# EAGLE design PDM_Final (EAGLE 6.6.0)
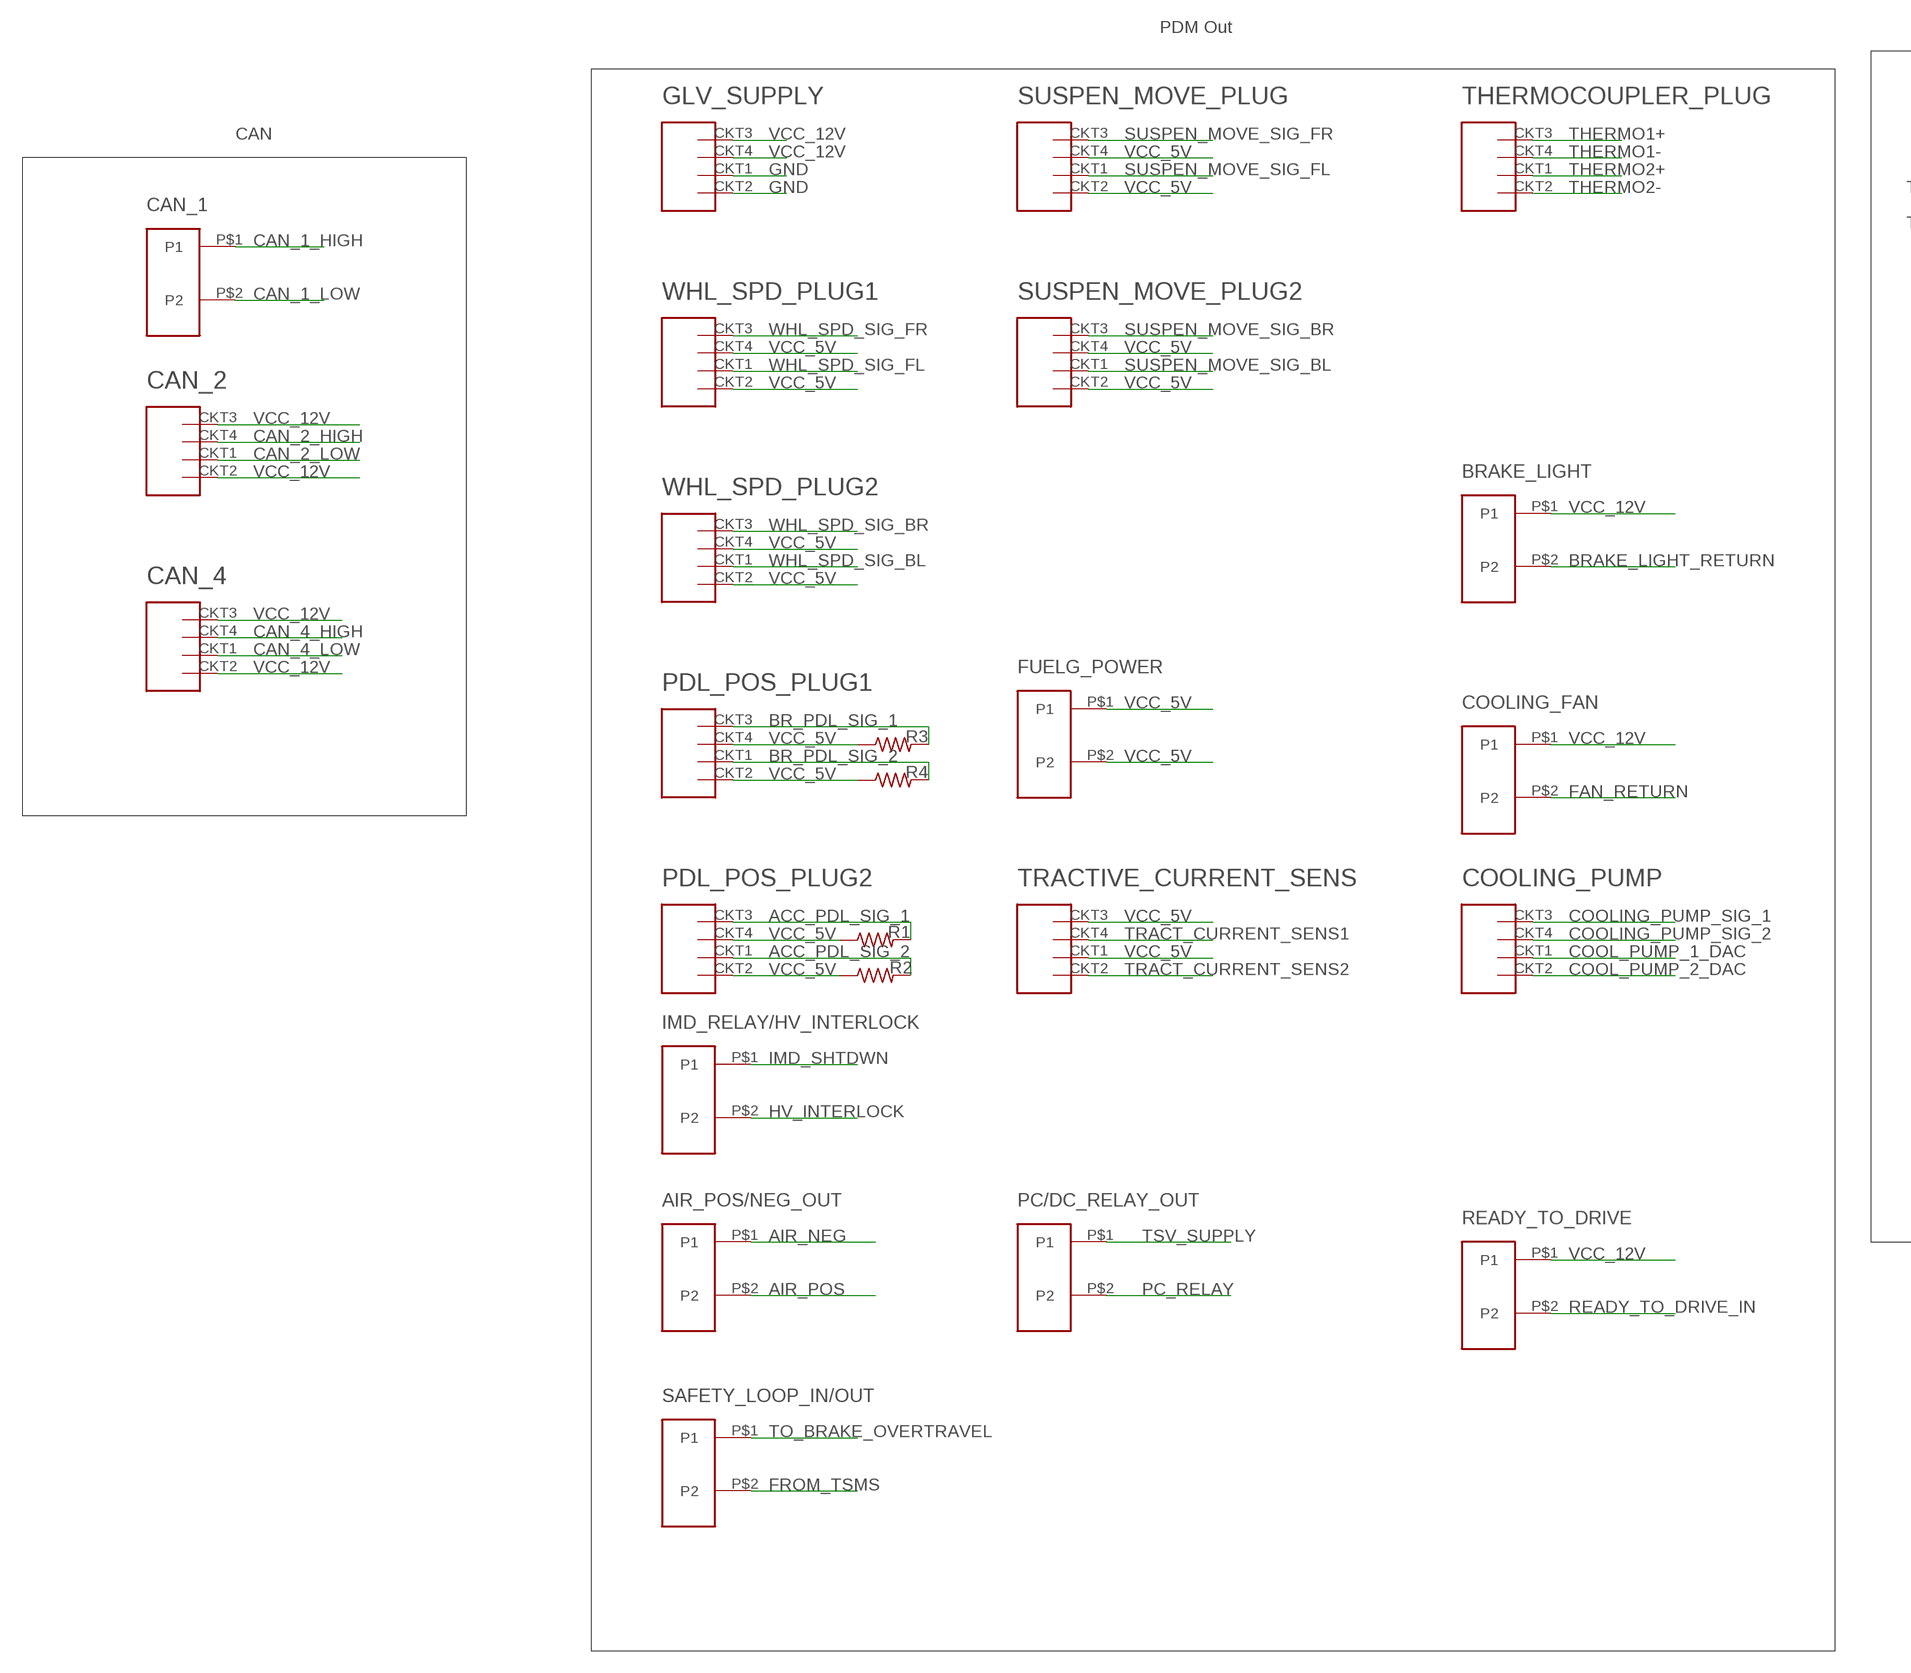
[diagram p0: schematic, sheet 1, part 1 of 2]
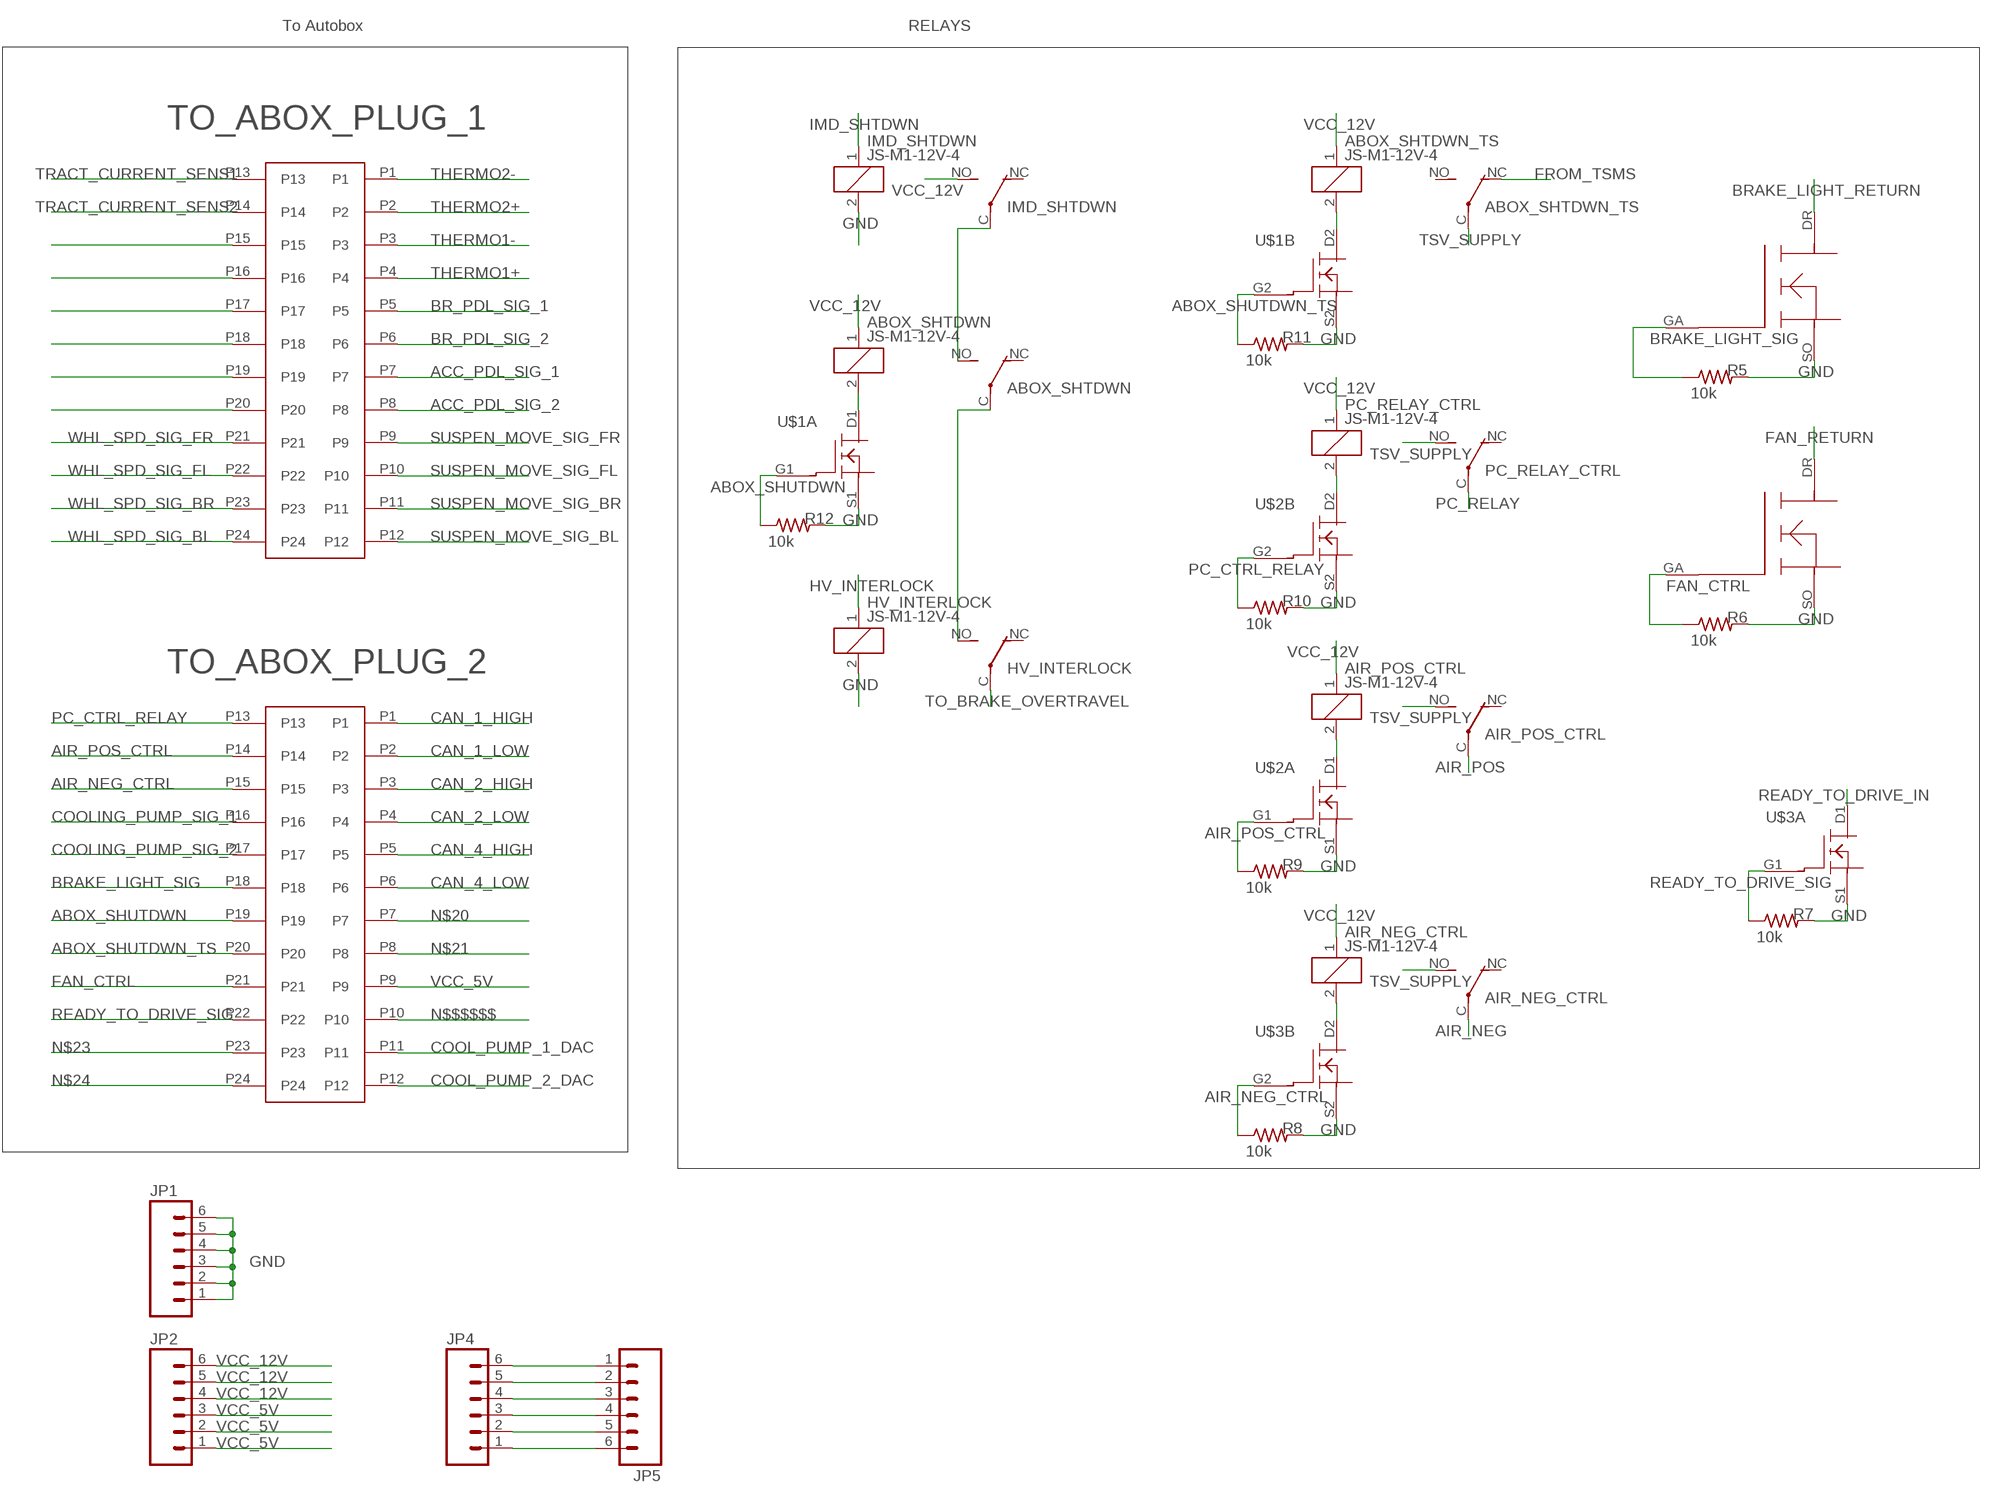
[diagram p1: schematic, sheet 1, part 2 of 2]

## Parts
ABOX_SHTDWN  JS-M1-12V-4  [JS-M]
ABOX_SHTDWN_TS  JS-M1-12V-4  [JS-M]
AIR_NEG_CTRL  JS-M1-12V-4  [JS-M]
AIR_POS/NEG_OUT  MINIFIT_2PIN  [2PIN_MOLEXMINIFIT]
AIR_POS_CTRL  JS-M1-12V-4  [JS-M]
BRAKE_LIGHT  MINIFIT_2PIN  [2PIN_MOLEXMINIFIT]
CAN_1  MINIFIT_2PIN  [2PIN_MOLEXMINIFIT]
CAN_2  MHYBRIDMOLEX  [MOLEXMINIFIT6]
CAN_4  MHYBRIDMOLEX  [MOLEXMINIFIT6]
COOLING_FAN  MINIFIT_2PIN  [2PIN_MOLEXMINIFIT]
COOLING_PUMP  MHYBRIDMOLEX  [MOLEXMINIFIT6]
FUELG_POWER  MINIFIT_2PIN  [2PIN_MOLEXMINIFIT]
GLV_SUPPLY  MHYBRIDMOLEX  [MOLEXMINIFIT6]
HV_INTERLOCK  JS-M1-12V-4  [JS-M]
IMD_RELAY/HV_INTERLOCK  MINIFIT_2PIN  [2PIN_MOLEXMINIFIT]
IMD_SHTDWN  JS-M1-12V-4  [JS-M]
JP1  M06LOCK  [1X06_LOCK]
JP2  M06LOCK  [1X06_LOCK]
JP4  M06LOCK  [1X06_LOCK]
JP5  M06LOCK  [1X06_LOCK]
PC/DC_RELAY_OUT  MINIFIT_2PIN  [2PIN_MOLEXMINIFIT]
PC_RELAY_CTRL  JS-M1-12V-4  [JS-M]
PDL_POS_PLUG1  MHYBRIDMOLEX  [MOLEXMINIFIT6]
PDL_POS_PLUG2  MHYBRIDMOLEX  [MOLEXMINIFIT6]
R1  R-US_0204/2V  [0204V]
R2  R-US_0204/2V  [0204V]
R3  R-US_0204/2V  [0204V]
R4  R-US_0204/2V  [0204V]
R5  10k  R-US_0204/2V  [0204V]
R6  10k  R-US_0204/2V  [0204V]
R7  10k  R-US_0204/2V  [0204V]
R8  10k  R-US_0204/2V  [0204V]
R9  10k  R-US_0204/2V  [0204V]
R10  10k  R-US_0204/2V  [0204V]
R11  10k  R-US_0204/2V  [0204V]
R12  10k  R-US_0204/2V  [0204V]
READY_TO_DRIVE  MINIFIT_2PIN  [2PIN_MOLEXMINIFIT]
SAFETY_LOOP_IN/OUT  MINIFIT_2PIN  [2PIN_MOLEXMINIFIT]
SUSPEN_MOVE_PLUG  MHYBRIDMOLEX  [MOLEXMINIFIT6]
SUSPEN_MOVE_PLUG2  MHYBRIDMOLEX  [MOLEXMINIFIT6]
THERMOCOUPLER_PLUG  MHYBRIDMOLEX  [MOLEXMINIFIT6]
TO_ABOX_PLUG_1  24PIN_MOLEX  [24PIN_MOLEX]
TO_ABOX_PLUG_2  24PIN_MOLEX  [24PIN_MOLEX]
TRACTIVE_CURRENT_SENS  MHYBRIDMOLEX  [MOLEXMINIFIT6]
U$1  COMBINED_TRANSIS  [TRANSIS_6]
U$2  COMBINED_TRANSIS  [TRANSIS_6]
U$3  COMBINED_TRANSIS  [TRANSIS_6]
U$4  HIGH_AMP_TRANS  [HIGH_AMP_TRANS]
U$5  HIGH_AMP_TRANS  [HIGH_AMP_TRANS]
WHL_SPD_PLUG1  MHYBRIDMOLEX  [MOLEXMINIFIT6]
WHL_SPD_PLUG2  MHYBRIDMOLEX  [MOLEXMINIFIT6]

## Nets
ABOX_SHUTDWN: R12.1 TO_ABOX_PLUG_2.P19 U$1.G1(A:GA)
ABOX_SHUTDWN_TS: R11.1 TO_ABOX_PLUG_2.P20 U$1.G2(B:GA)
ACC_PDL_SIG_1: PDL_POS_PLUG2.CKT3(V_IN(12)) R1.2 TO_ABOX_PLUG_1.P7
ACC_PDL_SIG_2: PDL_POS_PLUG2.CKT1(GND) R2.2 TO_ABOX_PLUG_1.P8
AIR_NEG: AIR_NEG_CTRL.C(2:P) AIR_POS/NEG_OUT.P$1(P1)
AIR_NEG_CTRL: R8.1 TO_ABOX_PLUG_2.P15 U$3.G2(B:GA)
AIR_POS: AIR_POS/NEG_OUT.P$2(P2) AIR_POS_CTRL.C(2:P)
AIR_POS_CTRL: R9.1 TO_ABOX_PLUG_2.P14 U$2.G1(A:GA)
BR_PDL_SIG_1: PDL_POS_PLUG1.CKT3(V_IN(12)) R3.2 TO_ABOX_PLUG_1.P5
BR_PDL_SIG_2: PDL_POS_PLUG1.CKT1(GND) R4.2 TO_ABOX_PLUG_1.P6
BRAKE_LIGHT_RETURN: BRAKE_LIGHT.P$2(P2) U$4.DR
BRAKE_LIGHT_SIG: R5.1 TO_ABOX_PLUG_2.P18 U$4.GA
CAN_1_HIGH: CAN_1.P$1(P1) TO_ABOX_PLUG_2.P1
CAN_1_LOW: CAN_1.P$2(P2) TO_ABOX_PLUG_2.P2
CAN_2_HIGH: CAN_2.CKT4(V_IN2(12)) TO_ABOX_PLUG_2.P3
CAN_2_LOW: CAN_2.CKT1(GND) TO_ABOX_PLUG_2.P4
CAN_4_HIGH: CAN_4.CKT4(V_IN2(12)) TO_ABOX_PLUG_2.P5
CAN_4_LOW: CAN_4.CKT1(GND) TO_ABOX_PLUG_2.P6
COOL_PUMP_1_DAC: COOLING_PUMP.CKT1(GND) TO_ABOX_PLUG_2.P11
COOL_PUMP_2_DAC: COOLING_PUMP.CKT2(GND2) TO_ABOX_PLUG_2.P12
COOLING_PUMP_SIG_1: COOLING_PUMP.CKT3(V_IN(12)) TO_ABOX_PLUG_2.P16
COOLING_PUMP_SIG_2: COOLING_PUMP.CKT4(V_IN2(12)) TO_ABOX_PLUG_2.P17
FAN_CTRL: R6.1 TO_ABOX_PLUG_2.P21 U$5.GA
FAN_RETURN: COOLING_FAN.P$2(P2) U$5.DR
FROM_TSMS: ABOX_SHTDWN_TS.NC(2:O) SAFETY_LOOP_IN/OUT.P$2(P2)
GND: GLV_SUPPLY.CKT1(GND) GLV_SUPPLY.CKT2(GND2) HV_INTERLOCK.2 IMD_SHTDWN.2 JP1.1 JP1.2 JP1.3 JP1.4 JP1.5 JP1.6 R5.2 R6.2 R7.2 R8.2 R9.2 R10.2 R11.2 R12.2 U$1.S1(A:SO) U$1.S2(B:SO) U$2.S1(A:SO) U$2.S2(B:SO) U$3.S1(A:SO) U$3.S2(B:SO) U$4.SO U$5.SO
HV_INTERLOCK: HV_INTERLOCK.1 IMD_RELAY/HV_INTERLOCK.P$2(P2)
IMD_SHTDWN: IMD_RELAY/HV_INTERLOCK.P$1(P1) IMD_SHTDWN.1
N$1: ABOX_SHTDWN.2 U$1.D1(A:DR)
N$2: ABOX_SHTDWN.NO(2:S) IMD_SHTDWN.C(2:P)
N$3: ABOX_SHTDWN.C(2:P) HV_INTERLOCK.NO(2:S)
N$4: ABOX_SHTDWN_TS.2 U$1.D2(B:DR)
N$5: PC_RELAY_CTRL.2 U$2.D2(B:DR)
N$6: TO_ABOX_PLUG_1.P20
N$7: TO_ABOX_PLUG_1.P19
N$8: TO_ABOX_PLUG_1.P18
N$9: TO_ABOX_PLUG_1.P17
N$10: TO_ABOX_PLUG_1.P16
N$11: TO_ABOX_PLUG_1.P15
N$12: AIR_POS_CTRL.2 U$2.D1(A:DR)
N$13: AIR_NEG_CTRL.2 U$3.D2(B:DR)
N$20: TO_ABOX_PLUG_2.P7
N$21: TO_ABOX_PLUG_2.P8
N$23: TO_ABOX_PLUG_2.P23
N$24: TO_ABOX_PLUG_2.P24
N$40: JP4.6 JP5.1
N$41: JP4.5 JP5.2
N$42: JP4.4 JP5.3
N$43: JP4.3 JP5.4
N$44: JP4.2 JP5.5
N$45: JP4.1 JP5.6
N$$$$$$: TO_ABOX_PLUG_2.P10
PC_CTRL_RELAY: R10.1 TO_ABOX_PLUG_2.P13 U$2.G2(B:GA)
PC_RELAY: PC/DC_RELAY_OUT.P$2(P2) PC_RELAY_CTRL.C(2:P)
READY_TO_DRIVE_IN: READY_TO_DRIVE.P$2(P2) U$3.D1(A:DR)
READY_TO_DRIVE_SIG: R7.1 TO_ABOX_PLUG_2.P22 U$3.G1(A:GA)
SUSPEN_MOVE_SIG_BL: SUSPEN_MOVE_PLUG2.CKT1(GND) TO_ABOX_PLUG_1.P12
SUSPEN_MOVE_SIG_BR: SUSPEN_MOVE_PLUG2.CKT3(V_IN(12)) TO_ABOX_PLUG_1.P11
SUSPEN_MOVE_SIG_FL: SUSPEN_MOVE_PLUG.CKT1(GND) TO_ABOX_PLUG_1.P10
SUSPEN_MOVE_SIG_FR: SUSPEN_MOVE_PLUG.CKT3(V_IN(12)) TO_ABOX_PLUG_1.P9
THERMO1+: THERMOCOUPLER_PLUG.CKT3(V_IN(12)) TO_ABOX_PLUG_1.P4
THERMO1-: THERMOCOUPLER_PLUG.CKT4(V_IN2(12)) TO_ABOX_PLUG_1.P3
THERMO2+: THERMOCOUPLER_PLUG.CKT1(GND) TO_ABOX_PLUG_1.P2
THERMO2-: THERMOCOUPLER_PLUG.CKT2(GND2) TO_ABOX_PLUG_1.P1
TO_BRAKE_OVERTRAVEL: HV_INTERLOCK.C(2:P) SAFETY_LOOP_IN/OUT.P$1(P1)
TRACT_CURRENT_SENS1: TO_ABOX_PLUG_1.P13 TRACTIVE_CURRENT_SENS.CKT4(V_IN2(12))
TRACT_CURRENT_SENS2: TO_ABOX_PLUG_1.P14 TRACTIVE_CURRENT_SENS.CKT2(GND2)
TSV_SUPPLY: ABOX_SHTDWN_TS.C(2:P) AIR_NEG_CTRL.NO(2:S) AIR_POS_CTRL.NO(2:S) PC/DC_RELAY_OUT.P$1(P1) PC_RELAY_CTRL.NO(2:S)
VCC_5V: FUELG_POWER.P$1(P1) FUELG_POWER.P$2(P2) JP2.1 JP2.2 JP2.3 PDL_POS_PLUG1.CKT2(GND2) PDL_POS_PLUG1.CKT4(V_IN2(12)) PDL_POS_PLUG2.CKT2(GND2) PDL_POS_PLUG2.CKT4(V_IN2(12)) R1.1 R2.1 R3.1 R4.1 SUSPEN_MOVE_PLUG2.CKT2(GND2) SUSPEN_MOVE_PLUG2.CKT4(V_IN2(12)) SUSPEN_MOVE_PLUG.CKT2(GND2) SUSPEN_MOVE_PLUG.CKT4(V_IN2(12)) TO_ABOX_PLUG_2.P9 TRACTIVE_CURRENT_SENS.CKT1(GND) TRACTIVE_CURRENT_SENS.CKT3(V_IN(12)) WHL_SPD_PLUG1.CKT2(GND2) WHL_SPD_PLUG1.CKT4(V_IN2(12)) WHL_SPD_PLUG2.CKT2(GND2) WHL_SPD_PLUG2.CKT4(V_IN2(12))
VCC_12V: ABOX_SHTDWN.1 ABOX_SHTDWN_TS.1 AIR_NEG_CTRL.1 AIR_POS_CTRL.1 BRAKE_LIGHT.P$1(P1) CAN_2.CKT2(GND2) CAN_2.CKT3(V_IN(12)) CAN_4.CKT2(GND2) CAN_4.CKT3(V_IN(12)) COOLING_FAN.P$1(P1) GLV_SUPPLY.CKT3(V_IN(12)) GLV_SUPPLY.CKT4(V_IN2(12)) IMD_SHTDWN.NO(2:S) JP2.4 JP2.5 JP2.6 PC_RELAY_CTRL.1 READY_TO_DRIVE.P$1(P1)
WHL_SPD_SIG_BL: TO_ABOX_PLUG_1.P24 WHL_SPD_PLUG2.CKT1(GND)
WHL_SPD_SIG_BR: TO_ABOX_PLUG_1.P23 WHL_SPD_PLUG2.CKT3(V_IN(12))
WHL_SPD_SIG_FL: TO_ABOX_PLUG_1.P22 WHL_SPD_PLUG1.CKT1(GND)
WHL_SPD_SIG_FR: TO_ABOX_PLUG_1.P21 WHL_SPD_PLUG1.CKT3(V_IN(12))
Unconnected: ABOX_SHTDWN.NC(2:O) ABOX_SHTDWN_TS.NO(2:S) AIR_NEG_CTRL.NC(2:O) AIR_POS_CTRL.NC(2:O) HV_INTERLOCK.NC(2:O) IMD_SHTDWN.NC(2:O) PC_RELAY_CTRL.NC(2:O)

## Notes on the sheet
- PDM Out | To Autobox | RELAYS
- CAN

## Library data of the parts
ABOX_SHTDWN ABOX_SHTDWN_TS AIR_NEG_CTRL AIR_POS_CTRL HV_INTERLOCK IMD_SHTDWN PC_RELAY_CTRL = relay:JS-M1*: Automotive Ultra-Miniature Power Relay NAiS Source: http://www.mew-europe.com/.. en_ds_61211_0000.pdf; MPN: JSM1-12V-4; OC_FARNELL: 910338; OC_NEWARK: 13P4552
AIR_POS/NEG_OUT BRAKE_LIGHT CAN_1 COOLING_FAN FUELG_POWER IMD_RELAY/HV_INTERLOCK PC/DC_RELAY_OUT READY_TO_DRIVE SAFETY_LOOP_IN/OUT = mhybrid molex megaFit:MINIFIT_2PIN
CAN_2 CAN_4 COOLING_PUMP GLV_SUPPLY PDL_POS_PLUG1 PDL_POS_PLUG2 SUSPEN_MOVE_PLUG SUSPEN_MOVE_PLUG2 THERMOCOUPLER_PLUG TRACTIVE_CURRENT_SENS WHL_SPD_PLUG1 WHL_SPD_PLUG2 = mhybrid molex megaFit:MHYBRIDMOLEX
JP1 JP2 JP4 JP5 = SparkFun-Connectors:M06: Header 6 Standard 6-pin 0.1" header. Use with straight break away headers (SKU : PRT-00116), right angle break away headers (PRT-00553), swiss pins (PRT-00743), machine pins (PRT-00117), and female headers (PRT-00115). Molex polarized connector foot print use with SKU : PRT-08094 with associated crimp pins and housings. NOTES ON THE VARIANTS LOCK and LOCK_LONGPADS... This footprint was designed to help hold the alignment of a through-hole component (i.e. 6-pin header) while soldering it into place. You may notice that each hole has been shifted either up or down by 0.005 of an inch from it's more standard position (which is a perfectly straight line). This slight alteration caused the pins (the squares in the middle) to touch the edges of the holes. Because they are alternating, it causes a "brace" to hold the component in place. 0.005 has proven to be the perfect amount of "off-center" position when using our standard breakaway headers. Although looks a little odd when you look at the bare footprint, once you have a header in there, the alteration is very hard to notice. Also,if you push a header all the way into place, it is covered up entirely on the bottom side. This idea of altering the position of holes to aid alignment will be further integrated into the Sparkfun Library for other footprints. It can help hold any component with 3 or more connection pins.
R1-R12 = rcl:R-US_: RESISTOR, American symbol
TO_ABOX_PLUG_1 TO_ABOX_PLUG_2 = mhybrid molex megaFit:24PIN_MOLEX
U$1-U$3 = mhybrid molex megaFit:COMBINED_TRANSIS
U$4 U$5 = mhybrid molex megaFit:HIGH_AMP_TRANS

## Board
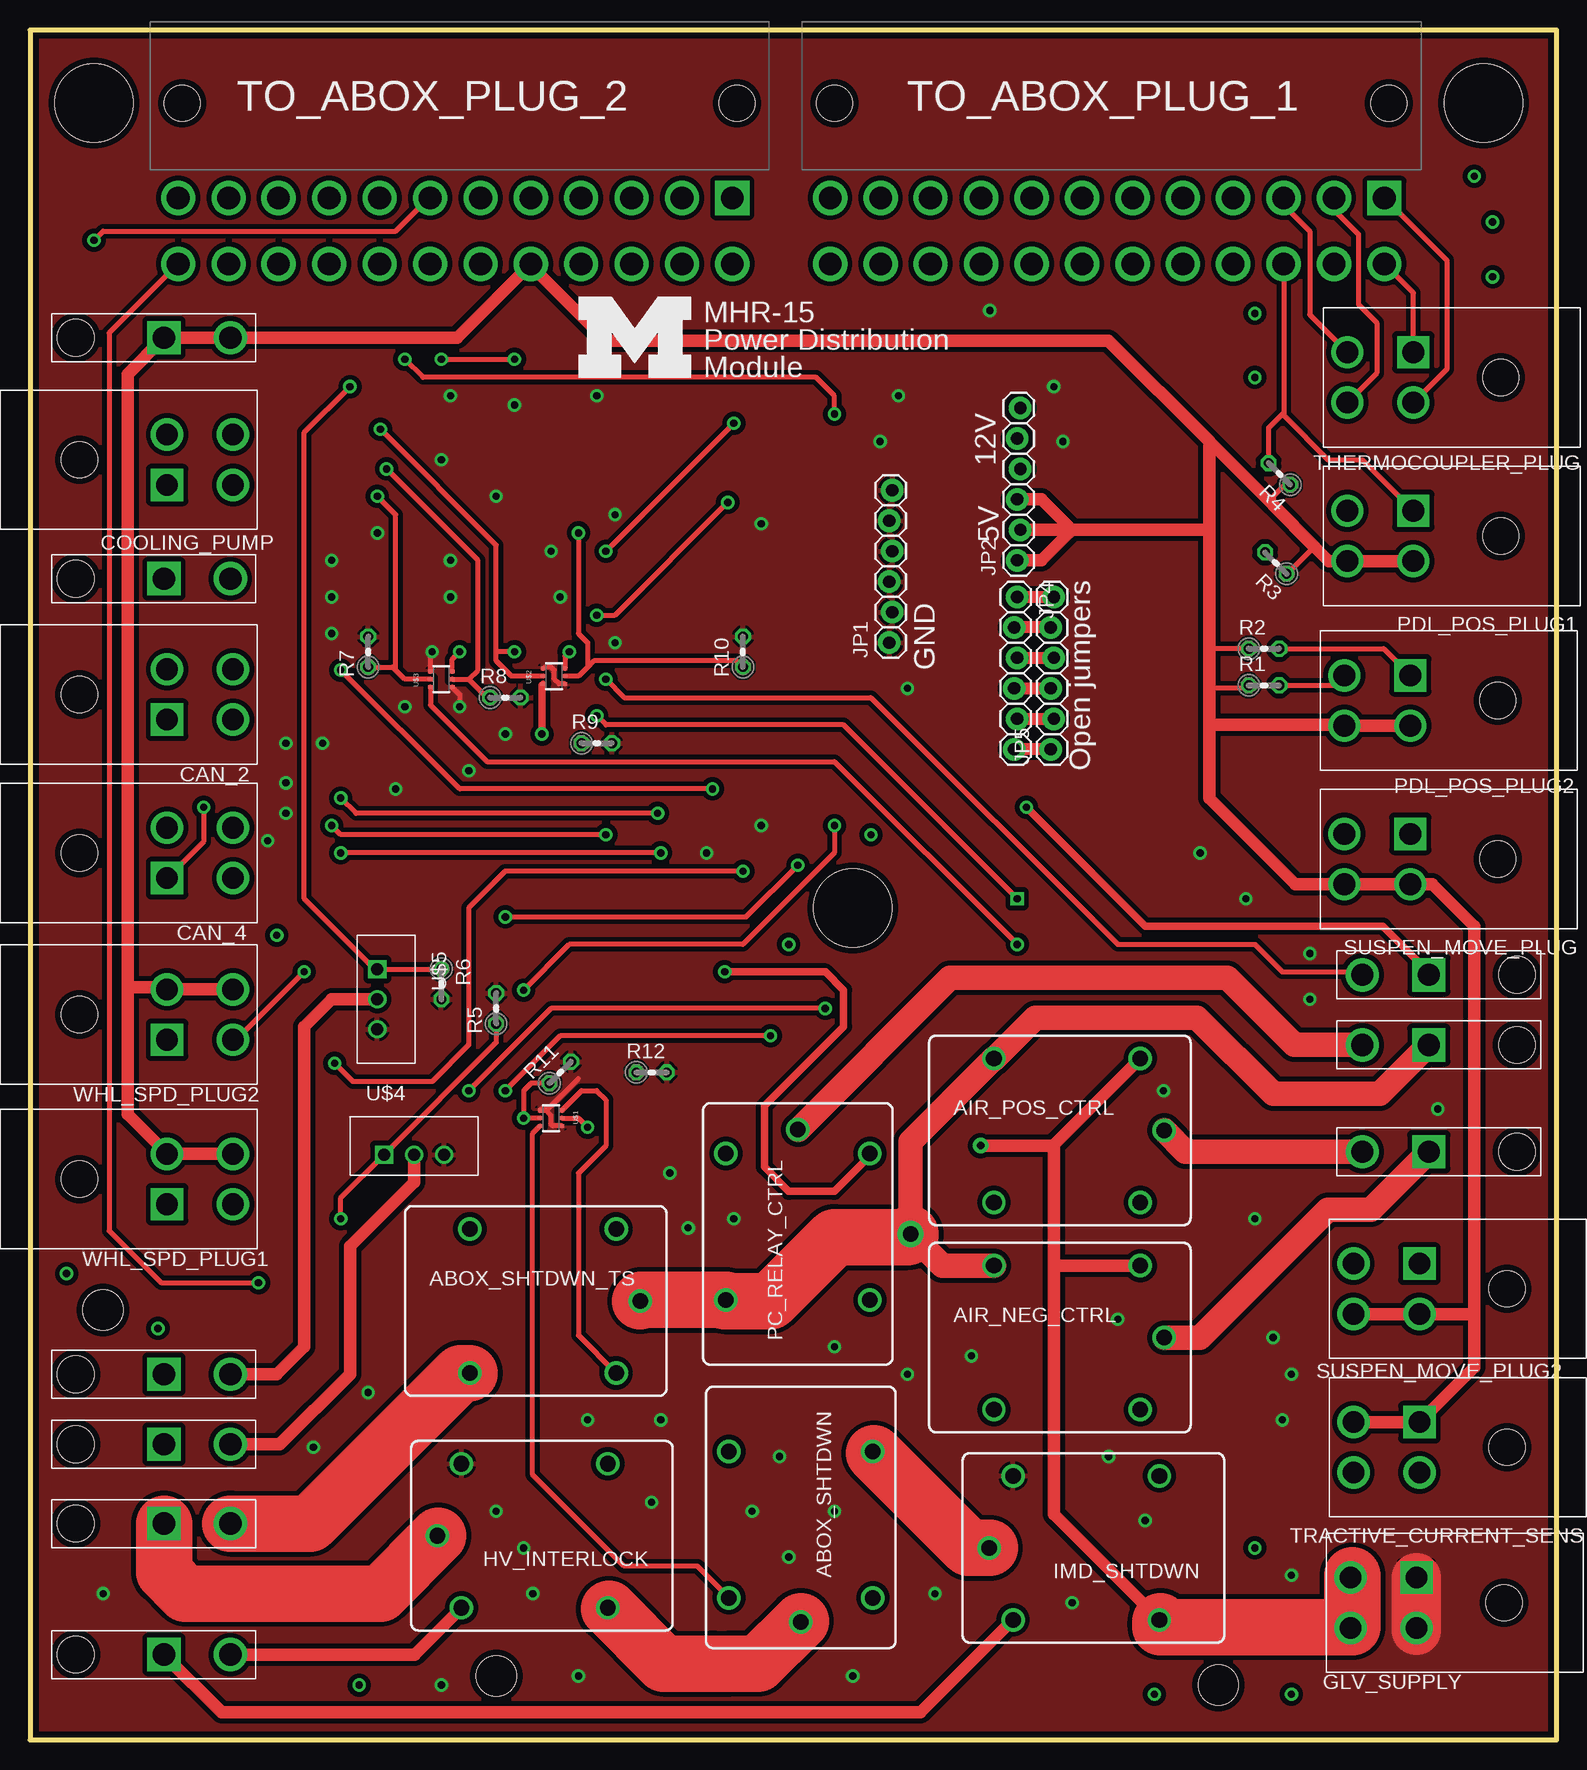
[diagram p2: board, top side]
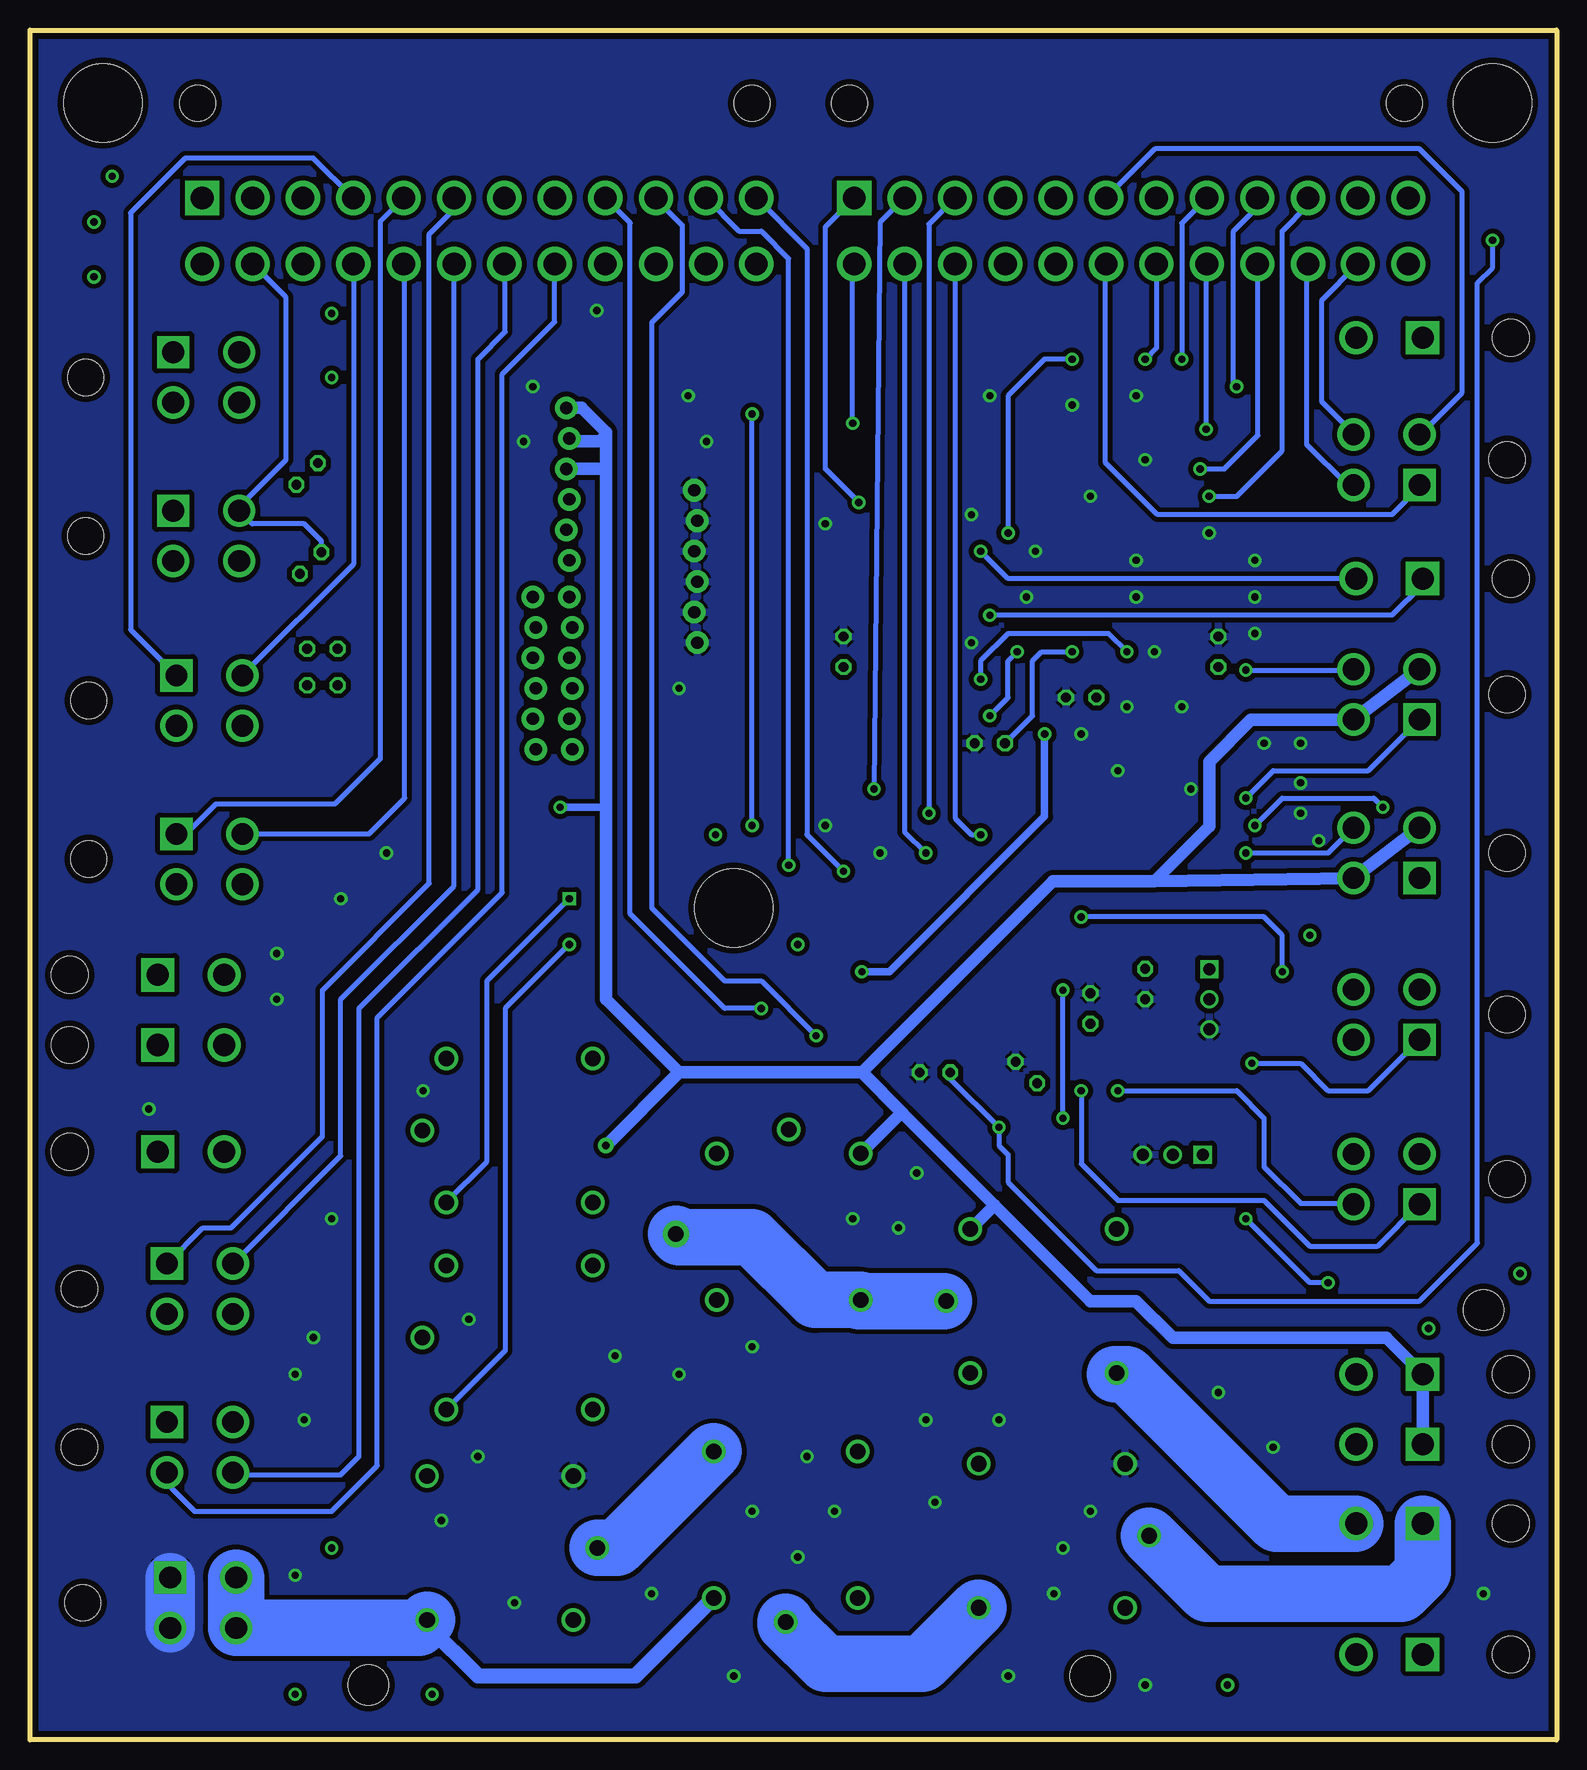
[diagram p3: board, bottom side, seen from below]

Size 127.25 x 142.49 mm. Coordinates in mm from the lower left corner, seen from the top.
Outline: 127.25,0 127.25,142.49 0,142.49 0,0 127.25,0
Copper layers (1+16): Top 0.0178mm / dielectric 12mil / Bottom 0.0178mm
Design rules "4PCB2layer": minimum track width 6mil, minimum drill 8mil, track to track 6mil, track to pad 6mil, pad to pad 6mil, via to via 6mil, smd to smd 6mil, copper to edge 20mil, drill to drill 16mil, minimum pad ring 10mil, minimum via ring 10mil, stop-mask expansion 3mil, vias tented up to drill 0mil, thermal gap 10mil
Holes 6.53 mm at 5.33,136.4 121.16,136.4 68.58,69.34
Holes 3.35 mm at 6.1,35.81 99.06,4.57 38.86,5.33

### Footprints (pad centres in the part's own frame; a part is rotated, then mirrored left to right if it is on the bottom)
JS-M = drill 1.3: 1 6.7,6; 2 6.7,-6; C 8.7,0; NC -5.5,-6; NO -5.5,6
2PIN_MOLEXMINIFIT = drill 1.85 square: P$1 0,7.35 | drill 1.85: P$2 0,12.89 | hole 3.05: 0,0
MOLEXMINIFIT6 = drill 1.8 square: CKT1 2.1,0 | drill 1.8: CKT2 -2.1,0; CKT3 2.1,5.5; CKT4 -2.1,5.5 | hole 3: 0,-7.3
1X06_LOCK = drill 1.016 pad 1.88: 1 0,0; 2 2.54,-0.254; 3 5.08,0; 4 7.62,-0.254; 5 10.16,0; 6 12.7,-0.254
0204V = drill 0.813 octagon: 1 -1.27,0; 2 1.27,0
24PIN_MOLEX = drill 1.9 square: P1 -22.735,7.9 | drill 1.9: P2 -22.735,13.4; P3 -18.53,7.9; P4 -14.33,7.9; P5 -18.53,13.4; P6 -14.33,13.4; P7 -10.12,13.4; P8 -10.12,7.9; P9 -5.94,13.4; P10 -5.94,7.9; P11 -1.74,13.4; P12 -1.74,7.9; P13 2.465,13.4; P14 6.665,13.4; P15 10.87,13.4; P16 15.1,13.4; P17 19.26,13.4; P18 23.465,13.4; P19 2.465,7.9; P20 6.665,7.9; P21 10.87,7.9; P22 15.1,7.9; P23 19.26,7.9; P24 23.465,7.9 | hole 2.997: -23.114,0; 23.114,0
TRANSIS_6 = smd 0.3 x 0.4: D1 0.65,-0.9; D2 -0.65,0.9; G1 0,0.9; G2 0,-0.9; S1 0.65,0.9; S2 -0.65,-0.9
HIGH_AMP_TRANS = drill 1: DR 0,0; SO 2.5,0 | drill 1 square: GA -2.5,0

### Placement (x,y rotation side)
ABOX_SHTDWN  64.26,18.54 270 top
ABOX_SHTDWN_TS  42.16,36.58 0 top
AIR_NEG_CTRL  85.85,33.53 0 top
AIR_POS/NEG_OUT  123.95,49.02 90 top
AIR_POS_CTRL  85.85,50.8 0 top
BRAKE_LIGHT  3.81,24.64 270 top
CAN_1  3.81,96.77 270 top
CAN_2  11.43,87.12 270 top
CAN_4  11.43,73.91 270 top
COOLING_FAN  3.81,30.48 270 top
COOLING_PUMP  11.43,106.68 270 top
FUELG_POWER  3.81,116.84 270 top
GLV_SUPPLY  115.57,11.43 90 top
HV_INTERLOCK  42.67,17.02 180 top
IMD_RELAY/HV_INTERLOCK  3.81,7.11 270 top
IMD_SHTDWN  88.65,16 180 top
JP1  71.63,91.44 90 top
JP2  82.3,98.3 90 top
JP4  82.3,95.25 270 top
JP5  85.09,82.55 90 top
PC/DC_RELAY_OUT  123.95,57.91 90 top
PC_RELAY_CTRL  64.01,42.16 90 top
PDL_POS_PLUG1  115.32,100.33 90 top
PDL_POS_PLUG2  115.06,86.61 90 top
R1  102.87,87.88 0 top
R2  102.87,90.93 0 top
R3  103.86,98.07 135 top
R4  104.15,105.5 135 top
R5  38.86,60.96 90 top
R6  34.29,62.99 270 top
R7  28.19,90.68 90 top
R8  39.62,86.87 0 top
R9  47.24,83.06 0 top
R10  59.44,90.68 90 top
R11  44.2,55.63 45 top
R12  51.82,55.63 0 top
READY_TO_DRIVE  123.95,63.75 90 top
SAFETY_LOOP_IN/OUT  3.81,18.03 270 top
SUSPEN_MOVE_PLUG  115.06,73.41 90 top
SUSPEN_MOVE_PLUG2  115.82,37.59 90 top
THERMOCOUPLER_PLUG  115.32,113.54 90 top
TO_ABOX_PLUG_1  90.17,136.4 180 top
TO_ABOX_PLUG_2  35.81,136.4 180 top
TRACTIVE_CURRENT_SENS  115.82,24.38 90 top
U$1  43.43,51.82 270 top
U$2  43.69,88.65 90 top
U$3  34.29,88.39 90 top
U$4  32,48.77 0 top
U$5  28.96,61.72 270 top
U$6  [BLOCKM]  45.72,113.54 0 top
WHL_SPD_PLUG1  11.43,46.74 270 top
WHL_SPD_PLUG2  11.43,60.45 270 top

### Tracks (layer width: path | path; a pad name or v marks a point on that pad's centre or on a via)
ABOX_SHUTDWN  (via drill 0.6)
  Top 0.406: U$1.G1 45.72,51.82 v46.48,51.05 | v5.33,124.97 6.1,125.73 30.48,125.73 33.35,128.6 | 33.53,128.78 33.35,128.6 | 33.35,128.6 TO_ABOX_PLUG_2.P19
  Bottom 0.406: v5.33,124.97 5.33,122.68 6.6,121.41 6.6,41.4 11.43,36.58 28.96,36.58 31.5,39.12 38.35,39.12 45.72,46.48 45.72,48.77 46.48,49.53 v46.48,51.05 50.55,55.12 R12.1
ABOX_SHUTDWN_TS  (via drill 0.6)
  Top 0.406: U$1.G2 v41.15,51.82 41.15,54.1 41.77,54.73 R11.1 | v41.15,62.48 44.96,66.29 59.44,66.29 67.06,73.91 v67.06,76.2 | v67.06,110.49 67.06,112.01 65.53,113.54 32.77,113.54 v31.24,115.06
  Bottom 0.406: TO_ABOX_PLUG_2.P20 31.24,126.41 v31.24,115.06 | v41.15,51.82 v41.15,62.48 | v67.06,76.2 v67.06,110.49
ACC_PDL_SIG_1
  Top 0.406: R1.2 108.73,87.88 PDL_POS_PLUG2.CKT3
  Bottom 0.406: TO_ABOX_PLUG_1.P7 100.29,97.99 PDL_POS_PLUG2.CKT3
ACC_PDL_SIG_2
  Top 0.406: R2.2 112.84,90.93 PDL_POS_PLUG2.CKT1
  Bottom 0.406: TO_ABOX_PLUG_1.P8 100.3,128.5 103.63,131.83 114.3,131.83 118.87,127.25 118.87,92.52 PDL_POS_PLUG2.CKT1
AIR_NEG
  Top 2.057: AIR_NEG_CTRL.C 97.54,33.53 108.2,44.2 111.78,44.2 AIR_POS/NEG_OUT.P$1
AIR_NEG_CTRL  (via drill 0.6)
  Top 0.406: U$3.G2 36.58,88.39 | 36.58,88.39 37.34,89.15 37.34,98.3 v29.72,105.92 | R8.1 38.1,86.87 36.58,88.39
  Bottom 0.406: v29.72,105.92 27.69,105.92 24.89,108.71 24.89,122.95 TO_ABOX_PLUG_2.P15
AIR_POS
  Top 2.057: AIR_POS_CTRL.C 96.33,49.02 AIR_POS/NEG_OUT.P$2
AIR_POS_CTRL  (via drill 0.6)
  Top 0.406: U$2.G1 40.13,88.65 38.86,89.92 38.86,90.68 | 38.86,90.68 38.86,99.57 v29.21,109.22 | v40.39,90.68 38.86,90.68
  Bottom 0.406: v29.21,109.22 29.21,122.94 TO_ABOX_PLUG_2.P14 | R9.1 43.69,85.34 43.69,89.92 42.93,90.68 v40.39,90.68
BR_PDL_SIG_1
  Bottom 0.406: TO_ABOX_PLUG_1.P5 105.92,120.22 105.92,106.68 109.82,102.78 PDL_POS_PLUG1.CKT3 108.73,101.35 104.39,101.35 102.96,99.91 R3.2
BR_PDL_SIG_2
  Top 0.406: TO_ABOX_PLUG_1.P6 104.5,110.49 | 104.5,110.49 104.5,110.38 108.2,106.68 111.07,106.68 PDL_POS_PLUG1.CKT1 | R4.2 103.25,109.35 104.39,110.49 104.5,110.49
BRAKE_LIGHT_RETURN
  Top 1.041: BRAKE_LIGHT.P$2 20.83,24.64 26.67,30.48 26.67,41.15 32,46.48 U$4.DR
BRAKE_LIGHT_SIG  (via drill 0.6)
  Top 0.406: TO_ABOX_PLUG_2.P18 6.6,117.25 6.6,42.42 10.92,38.1 v19.05,38.1 | v25.91,43.43 25.91,45.17 U$4.GA 38.86,58.13 R5.1
  Bottom 0.406: v19.05,38.1 20.57,38.1 v25.91,43.43
CAN_1_HIGH  (via drill 0.6)
  Top 0.406: v47.24,93.73 48.77,93.73 v58.17,103.12
  Bottom 0.406: TO_ABOX_PLUG_2.P1 60.96,126.09 60.96,105.92 v58.17,103.12 | CAN_1.P$1 11.16,96.28 13.72,93.73 v47.24,93.73
CAN_1_LOW  (via drill 0.6)
  Top 0.406: v48.01,99.06 v58.67,109.73
  Bottom 0.406: CAN_1.P$2 45.72,96.77 v48.01,99.06 | v58.67,109.73 58.67,122.87 TO_ABOX_PLUG_2.P2
CAN_2_HIGH  (via drill 0.6)
  Top 0.406: v56.9,79.25 35.81,79.25 v25.91,89.15
  Bottom 0.406: TO_ABOX_PLUG_2.P3 56.39,126.45 v56.9,79.25 | v25.91,89.15 17,89.15 CAN_2.CKT4
CAN_2_LOW  (via drill 0.6)
  Top 0.406: v52.32,77.22 27.18,77.22 v25.91,78.49
  Bottom 0.406: TO_ABOX_PLUG_2.P4 52.32,126.32 v52.32,77.22 | v25.91,78.49 23.62,80.77 15.68,80.77 CAN_2.CKT1
CAN_4_HIGH  (via drill 0.6)
  Top 0.406: v52.58,73.91 v25.91,73.91
  Bottom 0.406: TO_ABOX_PLUG_2.P5 54.34,75.68 v52.58,73.91 | v25.91,73.91 19.03,73.91 CAN_4.CKT4
CAN_4_LOW  (via drill 0.6)
  Top 0.406: v48.01,75.44 25.91,75.44 v25.15,76.2 | v14.48,77.72 14.48,74.86 CAN_4.CKT1
  Bottom 0.406: TO_ABOX_PLUG_2.P6 50.14,76.81 48.77,75.44 v48.01,75.44 | v25.15,76.2 22.86,78.49 15.24,78.49 v14.48,77.72
COOL_PUMP_1_DAC
  Bottom 0.406: COOLING_PUMP.CKT1 11.43,104.39 13.72,102.11 33.27,102.11 37.59,106.43 37.59,122.96 TO_ABOX_PLUG_2.P11
COOL_PUMP_2_DAC
  Bottom 0.406: COOLING_PUMP.CKT2 11.36,108.78 7.87,112.27 7.87,129.03 11.43,132.59 33.46,132.59 TO_ABOX_PLUG_2.P12
COOLING_PUMP_SIG_1
  Bottom 0.406: COOLING_PUMP.CKT3 17.46,104.58 20.83,107.95 20.83,122.88 TO_ABOX_PLUG_2.P16
COOLING_PUMP_SIG_2
  Bottom 0.406: COOLING_PUMP.CKT4 16.93,108.88 19.56,111.51 19.56,119.99 TO_ABOX_PLUG_2.P17
FAN_CTRL  (via drill 0.6)
  Top 0.406: v26.67,112.78 22.86,108.97 22.86,70.1 28.74,64.22 U$5.GA 34.25,64.22 R6.1
  Bottom 0.406: v26.67,112.78 26.92,113.03 26.92,125.73 24.94,127.71 TO_ABOX_PLUG_2.P21
FAN_RETURN
  Top 1.041: COOLING_FAN.P$2 20.57,30.48 22.86,32.77 22.86,59.44 25.15,61.72 U$5.DR
FROM_TSMS
  Top 4.699: SAFETY_LOOP_IN/OUT.P$2 23.37,18.03 35.91,30.58 ABOX_SHTDWN_TS.NC
GND  (via drill 0.6)
  Top 0.406: U$1.S1 43.58,51.17 43.43,51.31 43.43,52.07 42.93,52.58 42.65,52.58 U$1.S2 43.07,52.47 45.72,55.12 | U$2.S2 44.08,88 43.69,88.39 43.69,89.15 43.43,89.41 42.9,89.41 U$2.S1 | U$3.S1 33.39,90.54 v33.53,90.68 | U$3.S2 35.81,87.12 v35.81,86.11
  Top 4.115: GLV_SUPPLY.CKT1 115.57,9.14
  Bottom 4.115: GLV_SUPPLY.CKT1 GLV_SUPPLY.CKT2
  other vias: 39.62,83.82 43.43,99.06 40.39,111.25 38.86,103.63 34.29,106.68 35.05,112.01 47.24,112.01 48.77,102.11 28.96,100.58 25.15,98.3 25.15,95.25 25.15,92.2 31.24,86.11 36.58,80.77 30.48,79.25 24.38,83.06 21.34,83.06 21.34,79.76 21.34,77.22 19.81,74.93 35.05,95.25 35.05,98.3 44.2,95.25 48.77,91.44 60.96,76.2 56.39,73.91 60.96,101.35 70.87,108.2 86.11,108.2 85.34,112.78 80.01,119.13 97.54,73.91 101.35,70.1 94.49,54.1 102.11,43.43 103.63,33.53 53.34,47.24 104.39,26.67 105.16,13.72 45.72,5.33 34.29,4.57 52.58,26.67 46.48,26.67 75.44,12.19 63.25,15.24 60.2,19.05 62.48,23.62 41.15,16 38.86,19.05 41.91,12.19 51.82,19.81 67.06,19.05 67.06,32.77 73.15,30.48 78.49,32 86.87,11.43 92.96,18.29 89.92,23.62 90.68,35.05 58.67,43.43 54.86,42.67 105.16,30.48 117.35,52.58 106.68,61.72 23.62,24.38 28.19,28.96 6.1,12.19 68.58,5.33 106.68,65.53 72.39,112.01 73.15,87.63
  pour Bottom (isolate 0.406): 0,142.49 127.25,142.49 127.25,-0.76 0,-0.76
  pour Top (isolate 0.406): 0,142.49 127.25,142.49 127.25,0 0,0 0,141.73
HV_INTERLOCK
  Top 1.041: IMD_RELAY/HV_INTERLOCK.P$2 32.07,7.11 HV_INTERLOCK.1
IMD_SHTDWN
  Top 1.041: IMD_RELAY/HV_INTERLOCK.P$1 15.99,2.29 74.23,2.29 IMD_SHTDWN.1
N$1
  Top 0.406: ABOX_SHTDWN.2 55.63,14.48 49.53,14.48 41.91,22.1 41.91,50.54 U$1.D1
N$2
  Bottom 4.699: IMD_SHTDWN.C 78.3,16 ABOX_SHTDWN.NO
N$3
  Bottom 4.699: ABOX_SHTDWN.C 64.26,9.65 60.96,6.35 52.84,6.35 HV_INTERLOCK.NO
N$4
  Top 0.406: U$1.D2 45.97,54.1 47.24,54.1 48.01,53.34 48.01,49.53 45.72,47.24 45.72,33.72 ABOX_SHTDWN_TS.2
N$5  (via drill 0.6)
  Top 0.559: 42.67,87.88 U$2.D2
  Top 0.61: PC_RELAY_CTRL.2 70.01,48.67 67.06,45.72 63.25,45.72 61.21,47.75 61.21,52.83 67.82,59.44 67.82,62.48 66.29,64.01 v57.91,64.01 | v42.67,83.82 42.67,87.88
  Bottom 0.61: v57.91,64.01 55.63,64.01 42.67,76.96 v42.67,83.82
N$12  (via drill 0.6)
  Top 0.406: v82.3,70.1 67.82,84.58 48.01,84.58 v47.24,85.34 | v44.96,90.68 44.59,90.31 U$2.D1
  Bottom 0.406: AIR_POS_CTRL.2 89.15,48.2 89.15,63.25 v82.3,70.1 | v47.24,85.34 45.72,86.87 45.72,89.92 v44.96,90.68
N$13  (via drill 0.6)
  Top 0.406: U$3.D2 33.39,86.24 38.1,81.53 67.06,81.53 v82.3,66.29
  Bottom 0.406: AIR_NEG_CTRL.2 87.63,32.45 87.63,60.96 v82.3,66.29
N$30
  Top 4.699: 110.24,13.72 110.24,9.4 94.23,9.4 94.23,9.91
N$31
  Top 4.699: 70.36,23.88 78.23,16 80.01,16
N$35
  Top 4.699: 34.04,17.02 29.21,12.19 12.95,12.19 11.18,13.97 11.18,18.03
N$36
  Bottom 4.699: 16.76,18.03 23.37,18.03 35.81,30.48 36.83,30.48
N$37
  Bottom 4.699: 51.05,36.58 58.17,36.58
N$38
  Top 4.699: 48.26,10.92 52.83,6.35 56.9,6.35 58.42,6.35 60.71,6.35 64.26,9.91
N$40
  Top 1.016: JP5.1 JP4.6
N$41
  Top 1.016: JP4.5 JP5.2
N$42
  Top 1.016: JP4.4 JP5.3
N$43
  Top 1.016: JP4.3 JP5.4
N$44
  Top 1.016: JP5.5 JP4.2
N$45
  Top 1.016: JP4.1 JP5.6
N$48  (via drill 0.6)
  other vias: 10.67,34.29
N$49  (via drill 0.6)
  other vias: 93.73,3.81
N$50  (via drill 0.6)
  other vias: 105.16,3.81
N$51  (via drill 0.6)
  other vias: 70.1,75.44
N$52  (via drill 0.6)
  other vias: 63.25,66.29
N$53  (via drill 0.6)
  other vias: 20.57,67.06
N$54  (via drill 0.6)
  other vias: 3.05,38.86
N$55  (via drill 0.6)
  other vias: 27.43,4.57
N$56  (via drill 0.6)
  other vias: 102.11,16
N$57  (via drill 0.6)
  other vias: 121.92,121.92
N$58  (via drill 0.6)
  other vias: 121.92,126.49
N$59  (via drill 0.6)
  other vias: 120.4,130.3
N$60  (via drill 0.6)
  other vias: 102.11,118.87
N$61  (via drill 0.6)
  other vias: 102.11,113.54
PC_CTRL_RELAY  (via drill 0.6)
  Top 0.406: v34.29,115.06 v40.39,115.06 | v45.72,100.58 45.72,92.2 46.48,91.44 46.48,89.41 | 46.48,89.41 45.72,88.65 U$2.G2 | R10.1 58.93,89.92 46.99,89.92 46.48,89.41
  Bottom 0.406: TO_ABOX_PLUG_2.P13 33.35,116 v34.29,115.06 | v40.39,115.06 42.67,115.06 45.72,112.01 v45.72,100.58
PC_RELAY
  Top 2.057: PC_RELAY_CTRL.C 64.07,50.86 76.71,63.5 99.82,63.5 105.41,57.91 PC/DC_RELAY_OUT.P$2
READY_TO_DRIVE_IN  (via drill 0.6)
  Top 0.406: U$3.D1 35.19,90.05 v35.81,90.68 | READY_TO_DRIVE.P$2 110.81,64.01 104.39,64.01 102.11,66.29 90.68,66.29 70.1,86.87 49.53,86.87 v48.01,88.39
  Bottom 0.406: v35.81,90.68 37.34,92.2 45.72,92.2 48.01,89.92 v48.01,88.39
READY_TO_DRIVE_SIG  (via drill 0.6)
  Top 0.406: U$3.G1 31.24,88.39 30.48,89.15 | 30.48,89.15 30.48,102.11 v28.96,103.63 | R7.1 30.23,89.41 30.48,89.15
  Bottom 0.406: v28.96,103.63 26.67,103.63 22.86,107.44 22.86,125.73 20.71,127.88 TO_ABOX_PLUG_2.P22
SUSPEN_MOVE_SIG_BL
  Bottom 0.406: SUSPEN_MOVE_PLUG2.CKT1 112.84,42.67 110.49,42.67 102.87,50.29 102.87,62.48 93.98,71.37 93.98,125.48 91.91,127.55 TO_ABOX_PLUG_1.P12
SUSPEN_MOVE_SIG_BR
  Bottom 0.406: SUSPEN_MOVE_PLUG2.CKT3 101.35,48.67 101.35,61.72 91.91,71.16 TO_ABOX_PLUG_1.P11
SUSPEN_MOVE_SIG_FL
  Bottom 0.406: 114.99,75.51 SUSPEN_MOVE_PLUG.CKT1 114.23,75.51 111.76,77.98 101.85,77.98 98.04,81.79 98.04,126.56 TO_ABOX_PLUG_1.P10
SUSPEN_MOVE_SIG_FR
  Bottom 0.406: SUSPEN_MOVE_PLUG.CKT3 98.99,75.51 96.01,78.49 96.01,122.9 TO_ABOX_PLUG_1.P9
THERMO1+
  Top 0.406: TO_ABOX_PLUG_1.P4 104.5,127.91 106.68,125.73 106.68,118.77 THERMOCOUPLER_PLUG.CKT3
THERMO1-
  Top 0.406: TO_ABOX_PLUG_1.P3 108.7,127.52 110.74,125.48 110.74,119.63 112.27,118.11 112.27,113.89 THERMOCOUPLER_PLUG.CKT4
THERMO2+
  Top 0.406: THERMOCOUPLER_PLUG.CKT1 115.32,120.59 TO_ABOX_PLUG_1.P2
THERMO2-
  Top 0.406: TO_ABOX_PLUG_1.P1 118.11,123.29 118.11,114.23 THERMOCOUPLER_PLUG.CKT2
TO_BRAKE_OVERTRAVEL
  Bottom 4.699: HV_INTERLOCK.C 29.15,12.19 12.95,12.19 11.16,13.99 SAFETY_LOOP_IN/OUT.P$1
TRACT_CURRENT_SENS1
  Bottom 0.406: TRACTIVE_CURRENT_SENS.CKT4 110.14,22.1 101.35,22.1 99.82,23.62 99.82,60.96 89.92,70.87 89.92,115.06 87.63,117.35 87.63,122.92 TO_ABOX_PLUG_1.P13
TRACT_CURRENT_SENS2
  Bottom 0.406: TRACTIVE_CURRENT_SENS.CKT2 115.82,21.34 113.54,19.05 102.11,19.05 98.3,22.86 98.3,60.2 87.88,70.61 87.88,113.79 83.5,118.17 TO_ABOX_PLUG_1.P14 83.31,122.81
TSV_SUPPLY  (via drill 1.3 pad 2.18)
  Top 2.057: v73.41,42.16 76.04,39.53 AIR_NEG_CTRL.NO | AIR_POS_CTRL.NO 80.35,56.73 | 73.91,42.67 v73.41,42.16 | v73.41,42.16 73.41,49.85 AIR_POS_CTRL.NO | AIR_POS_CTRL.NO 80.42,56.8 83.82,60.2 97.28,60.2 103.63,53.85 112.54,53.85 PC/DC_RELAY_OUT.P$1
  Top 4.699: ABOX_SHTDWN_TS.C 50.95,36.66 PC_RELAY_CTRL.NO | 57.91,36.58 61.72,36.58 67.06,41.91 73.15,41.91 arc90 v73.41,42.16
  Bottom 4.699: PC_RELAY_CTRL.NO 61.81,36.66 67.06,41.91 73.15,41.91 v73.41,42.16
VCC_5V
  Top 0.406: R1.1 101.35,87.63 98.3,87.63 | R2.1 98.55,90.93 98.3,90.68 | R4.1 104.6,104.6 103.63,103.63 103.63,102.87 | R3.1 104.8,97.18 107.06,99.44
  Top 1.041: 8.13,62.74 8.13,113.81 FUELG_POWER.P$1 FUELG_POWER.P$2 35.6,116.84 TO_ABOX_PLUG_2.P9 41.75,122.84 48.01,116.59 89.92,116.59 98.3,108.2 | 98.3,108.2 103.63,102.87 107.06,99.44 108.27,98.23 PDL_POS_PLUG1.CKT4 PDL_POS_PLUG1.CKT2 | PDL_POS_PLUG2.CKT2 PDL_POS_PLUG2.CKT4 109.66,84.51 109.73,84.58 98.3,84.58 | 120.4,35.81 120.4,67.82 116.91,71.31 SUSPEN_MOVE_PLUG.CKT2 SUSPEN_MOVE_PLUG.CKT4 105.48,71.31 98.3,78.49 98.3,84.58 | 120.4,35.81 120.4,31.06 TRACTIVE_CURRENT_SENS.CKT1 115.64,26.67 115.06,26.67 114.88,26.48 TRACTIVE_CURRENT_SENS.CKT3 | SUSPEN_MOVE_PLUG2.CKT4 SUSPEN_MOVE_PLUG2.CKT2 120.07,35.49 120.4,35.81 | WHL_SPD_PLUG2.CKT4 WHL_SPD_PLUG2.CKT2 11.24,62.74 8.13,62.74 | 8.13,62.74 8.13,52.14 WHL_SPD_PLUG1.CKT2 WHL_SPD_PLUG1.CKT4 | 98.3,84.58 98.3,87.63 98.3,90.68 98.3,100.58 | 98.3,100.58 98.3,108.2 | 82.8,100.58 JP2.2 86.11,100.84 | 86.11,100.84 86.87,100.84 | 86.87,100.84 98.04,100.84 98.3,100.58 | JP2.3 84.33,103.38 86.87,100.84 | JP2.1 84.33,98.3 86.61,100.58 86.36,100.58 86.11,100.84
VCC_12V  (via drill 0.6, 0.6 pad 1.27)
  Top 0.61: READY_TO_DRIVE.P$1 116.6,63.99 112.78,67.82 92.96,67.82 v83.06,77.72
  Top 1.041: IMD_SHTDWN.NO 85.34,18.8 85.34,39.62 | 85.34,39.62 85.34,49.59 | 85.34,49.59 AIR_POS_CTRL.1 | AIR_NEG_CTRL.1 85.44,39.53 85.34,39.62 | 85.34,49.59 85.28,49.53 v79.25,49.53
  Bottom 0.61: v83.06,77.72 79.25,77.72
  Bottom 1.041: v79.25,49.53 73.15,55.63 | 73.15,55.63 57.91,55.63 | 57.91,55.63 54.48,52.2 | 54.48,52.2 46.86,44.58 | 46.86,44.58 38.86,36.58 35.05,36.58 32,33.53 14.21,33.53 COOLING_FAN.P$1 BRAKE_LIGHT.P$1 | PC_RELAY_CTRL.1 54.67,52.2 54.48,52.2 | ABOX_SHTDWN_TS.1 46.86,44.58 | 33.53,71.56 CAN_4.CKT3 CAN_4.CKT2 | 33.53,71.56 41.98,71.56 57.91,55.63 | 33.53,71.56 28.96,76.13 28.96,81.53 25.47,85.02 CAN_2.CKT3 CAN_2.CKT2 | 79.25,105.92 79.25,77.72 79.25,61.72 73.15,55.63 | 79.25,105.92 79.25,108.2 | 79.25,108.2 79.25,108.97 81.28,111 JP2.6 | 79.5,108.46 79.25,108.2 | JP2.5 82.04,108.2 79.25,108.2 | JP2.4 79.25,105.92
  Bottom 1.27: IMD_SHTDWN.NO 94.15,9.56 89.92,5.33 76.77,5.33 ABOX_SHTDWN.1
  Bottom 4.699: GLV_SUPPLY.CKT3 GLV_SUPPLY.CKT4 94.82,9.33 IMD_SHTDWN.NO
WHL_SPD_SIG_BL  (via drill 0.6)
  Top 0.406: v59.44,72.39 39.62,72.39 36.58,69.34 36.58,57.91 33.53,54.86 26.92,54.86 v25.4,56.39
  Bottom 0.406: TO_ABOX_PLUG_1.P24 62.48,124.28 62.48,75.44 v59.44,72.39 | v25.4,56.39 21.34,56.39 19.05,54.1 15.68,54.1 WHL_SPD_PLUG2.CKT1
WHL_SPD_SIG_BR  (via drill 0.6)
  Top 0.406: WHL_SPD_PLUG2.CKT3 17.2,58.35 v22.86,64.01 | v39.62,68.58 59.69,68.58 v64.01,72.9
  Bottom 0.406: TO_ABOX_PLUG_1.P23 68.14,125.73 66.29,125.73 64.01,123.44 v64.01,72.9 | v22.86,64.01 22.86,67.06 24.38,68.58 v39.62,68.58
WHL_SPD_SIG_FL  (via drill 0.6)
  Top 0.406: v61.72,58.67 44.2,58.67 v39.62,54.1
  Bottom 0.406: TO_ABOX_PLUG_1.P22 75.07,128.41 72.9,126.24 72.9,120.65 75.44,118.11 75.44,69.34 69.34,63.25 66.29,63.25 v61.72,58.67 | v39.62,54.1 39.62,48.01 36.58,44.96 24.38,44.96 20.57,41.15 14.92,41.15 WHL_SPD_PLUG1.CKT1
WHL_SPD_SIG_FR  (via drill 0.6)
  Top 0.406: v66.29,60.96 43.43,60.96 v36.58,54.1
  Bottom 0.406: TO_ABOX_PLUG_1.P21 77.51,126.71 77.22,126.41 77.22,68.83 69.34,60.96 v66.29,60.96 | v36.58,54.1 26.67,54.1 24.38,51.82 24.38,47.75 21.34,44.7 17,44.7 WHL_SPD_PLUG1.CKT3

### Text on the board
tNames: MHR-15 | Power Distribution | Module | 12V | 5V | GND | Open jumpers